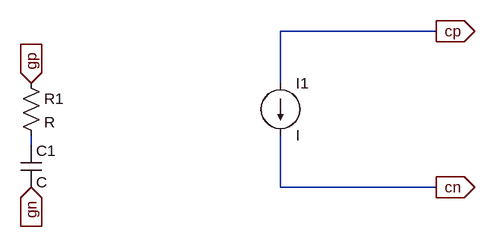
[diagram p0: schematic capteurGaz.asc]
capteurGaz.asc, the LTspice schematic file:
Version 4
SHEET 1 880 680
WIRE 736 0 496 0
WIRE 496 80 496 0
WIRE 112 176 112 160
WIRE 496 240 496 160
WIRE 736 240 496 240
FLAG 112 80 gp
IOPIN 112 80 In
FLAG 112 240 gn
IOPIN 112 240 In
FLAG 736 0 cp
IOPIN 736 0 Out
FLAG 736 240 cn
IOPIN 736 240 Out
SYMBOL cap 96 176 R0
SYMATTR InstName C1
SYMBOL res 96 64 R0
SYMATTR InstName R1
SYMBOL current 496 80 R0
SYMATTR InstName I1

The netlist it stands for:
* capteurGaz.asc
C1 N001 gn C
R1 gp N001 R
I1 cp cn I
.backanno
.end